# EasyEDA schematic Magellan ISO - Board B.json
TITLE: Magellan ISO - Board B; REV: 1.0; Date: 2017-10-26; Sheet: 1/1; Drawn By: mgizmor37
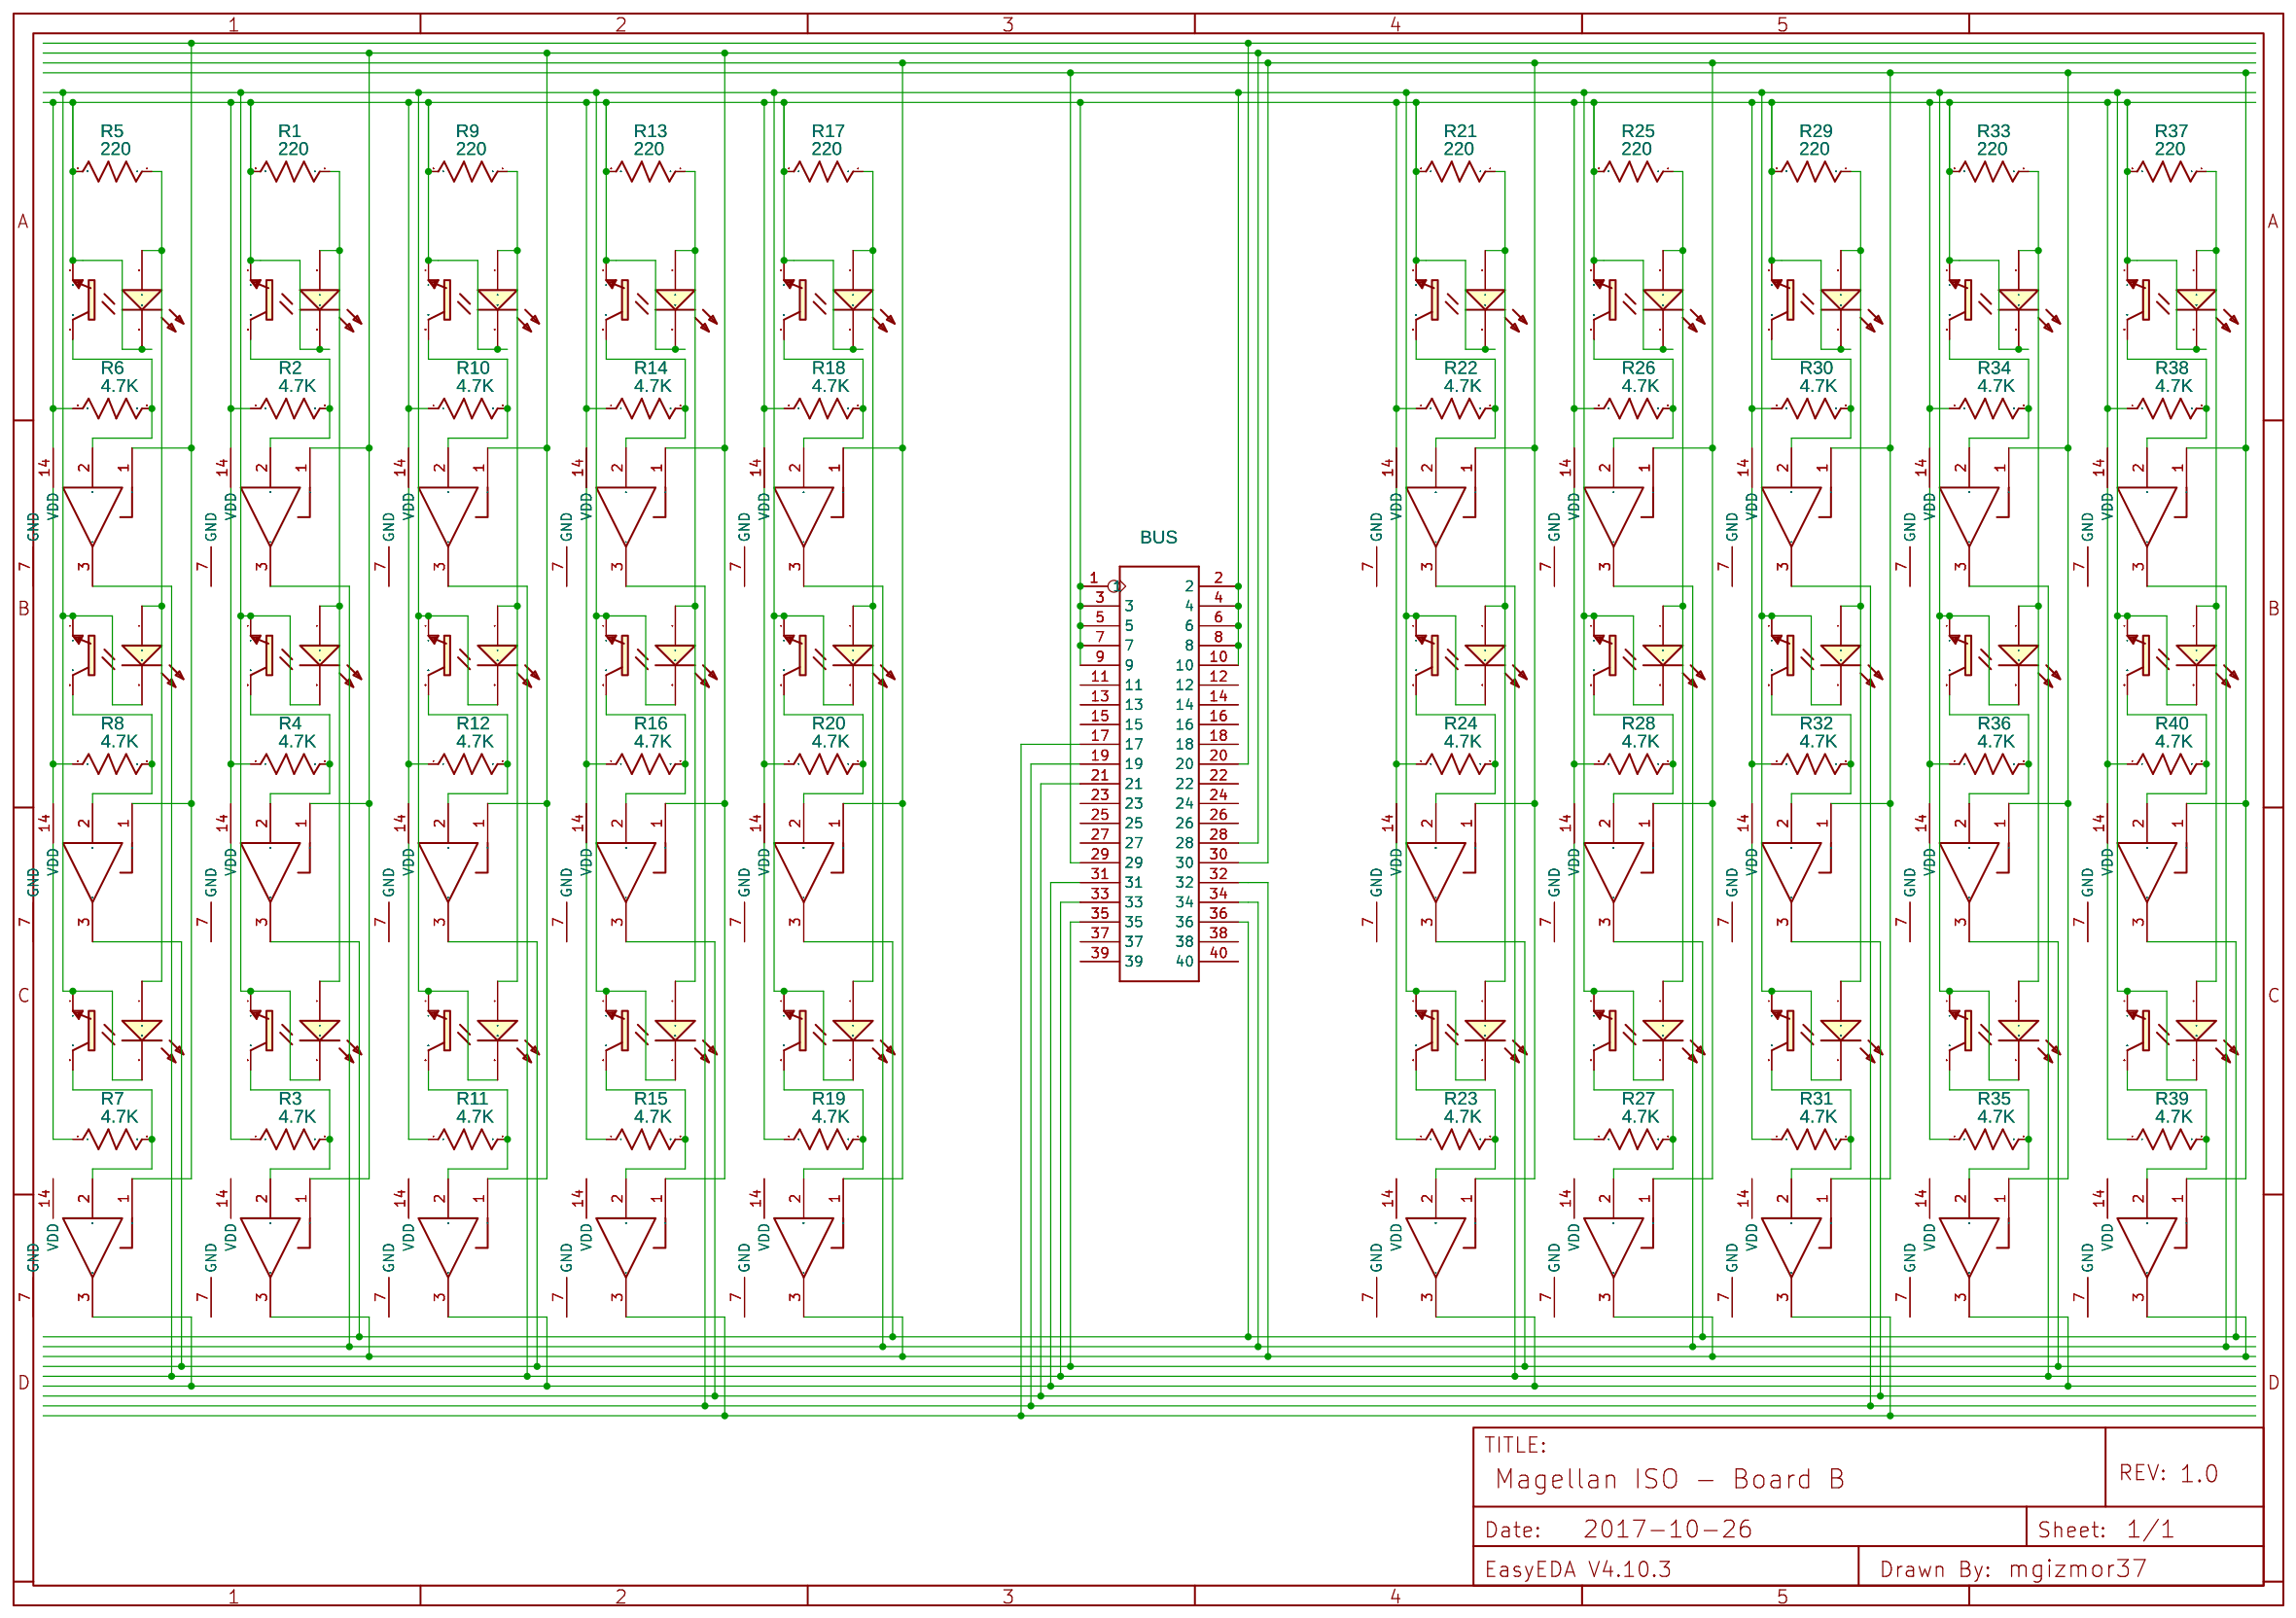
[diagram p0: schematic sheet]

## Parts
BUS  DIP-BLACK-HEADER-FEMALE-VERT-RASPPI(2X13P-2.54)  [40 Pin Header (Rasp Pi Layout)]
LED1  204-10UYC/S530-A3  [LED-3MM/2.54]
LED2  204-10UYC/S530-A3  [LED-3MM/2.54]
LED3  204-10UYC/S530-A3  [LED-3MM/2.54]
LED4  204-10UYC/S530-A3  [LED-3MM/2.54]
LED5  204-10UYC/S530-A3  [LED-3MM/2.54]
LED6  204-10UYC/S530-A3  [LED-3MM/2.54]
LED7  204-10UYC/S530-A3  [LED-3MM/2.54]
LED8  204-10UYC/S530-A3  [LED-3MM/2.54]
LED9  204-10UYC/S530-A3  [LED-3MM/2.54]
LED10  204-10UYC/S530-A3  [LED-3MM/2.54]
LED11  204-10UYC/S530-A3  [LED-3MM/2.54]
LED12  204-10UYC/S530-A3  [LED-3MM/2.54]
LED13  204-10UYC/S530-A3  [LED-3MM/2.54]
LED14  204-10UYC/S530-A3  [LED-3MM/2.54]
LED15  204-10UYC/S530-A3  [LED-3MM/2.54]
LED16  204-10UYC/S530-A3  [LED-3MM/2.54]
LED17  204-10UYC/S530-A3  [LED-3MM/2.54]
LED18  204-10UYC/S530-A3  [LED-3MM/2.54]
LED19  204-10UYC/S530-A3  [LED-3MM/2.54]
LED20  204-10UYC/S530-A3  [LED-3MM/2.54]
LED21  204-10UYC/S530-A3  [LED-3MM/2.54]
LED22  204-10UYC/S530-A3  [LED-3MM/2.54]
LED23  204-10UYC/S530-A3  [LED-3MM/2.54]
LED24  204-10UYC/S530-A3  [LED-3MM/2.54]
LED25  204-10UYC/S530-A3  [LED-3MM/2.54]
LED26  204-10UYC/S530-A3  [LED-3MM/2.54]
LED27  204-10UYC/S530-A3  [LED-3MM/2.54]
LED28  204-10UYC/S530-A3  [LED-3MM/2.54]
LED29  204-10UYC/S530-A3  [LED-3MM/2.54]
LED30  204-10UYC/S530-A3  [LED-3MM/2.54]
Q1  PHOTOTRANSISTORPT17-21C-L41-TR8  [PT17-21C-L41-TR8]
Q2  PHOTOTRANSISTORPT17-21C-L41-TR8  [PT17-21C-L41-TR8]
Q3  PHOTOTRANSISTORPT17-21C-L41-TR8  [PT17-21C-L41-TR8]
Q4  PHOTOTRANSISTORPT17-21C-L41-TR8  [PT17-21C-L41-TR8]
Q5  PHOTOTRANSISTORPT17-21C-L41-TR8  [PT17-21C-L41-TR8]
Q6  PHOTOTRANSISTORPT17-21C-L41-TR8  [PT17-21C-L41-TR8]
Q7  PHOTOTRANSISTORPT17-21C-L41-TR8  [PT17-21C-L41-TR8]
Q8  PHOTOTRANSISTORPT17-21C-L41-TR8  [PT17-21C-L41-TR8]
Q9  PHOTOTRANSISTORPT17-21C-L41-TR8  [PT17-21C-L41-TR8]
Q10  PHOTOTRANSISTORPT17-21C-L41-TR8  [PT17-21C-L41-TR8]
Q11  PHOTOTRANSISTORPT17-21C-L41-TR8  [PT17-21C-L41-TR8]
Q12  PHOTOTRANSISTORPT17-21C-L41-TR8  [PT17-21C-L41-TR8]
Q13  PHOTOTRANSISTORPT17-21C-L41-TR8  [PT17-21C-L41-TR8]
Q14  PHOTOTRANSISTORPT17-21C-L41-TR8  [PT17-21C-L41-TR8]
Q15  PHOTOTRANSISTORPT17-21C-L41-TR8  [PT17-21C-L41-TR8]
Q16  PHOTOTRANSISTORPT17-21C-L41-TR8  [PT17-21C-L41-TR8]
Q17  PHOTOTRANSISTORPT17-21C-L41-TR8  [PT17-21C-L41-TR8]
Q18  PHOTOTRANSISTORPT17-21C-L41-TR8  [PT17-21C-L41-TR8]
Q19  PHOTOTRANSISTORPT17-21C-L41-TR8  [PT17-21C-L41-TR8]
Q20  PHOTOTRANSISTORPT17-21C-L41-TR8  [PT17-21C-L41-TR8]
Q21  PHOTOTRANSISTORPT17-21C-L41-TR8  [PT17-21C-L41-TR8]
Q22  PHOTOTRANSISTORPT17-21C-L41-TR8  [PT17-21C-L41-TR8]
Q23  PHOTOTRANSISTORPT17-21C-L41-TR8  [PT17-21C-L41-TR8]
Q24  PHOTOTRANSISTORPT17-21C-L41-TR8  [PT17-21C-L41-TR8]
Q25  PHOTOTRANSISTORPT17-21C-L41-TR8  [PT17-21C-L41-TR8]
Q26  PHOTOTRANSISTORPT17-21C-L41-TR8  [PT17-21C-L41-TR8]
Q27  PHOTOTRANSISTORPT17-21C-L41-TR8  [PT17-21C-L41-TR8]
Q28  PHOTOTRANSISTORPT17-21C-L41-TR8  [PT17-21C-L41-TR8]
Q29  PHOTOTRANSISTORPT17-21C-L41-TR8  [PT17-21C-L41-TR8]
Q30  PHOTOTRANSISTORPT17-21C-L41-TR8  [PT17-21C-L41-TR8]
R1  220  [AXIAL-0.3]
R2  4.7K  [AXIAL-0.3]
R3  4.7K  [AXIAL-0.3]
R4  4.7K  [AXIAL-0.3]
R5  220  [AXIAL-0.3]
R6  4.7K  [AXIAL-0.3]
R7  4.7K  [AXIAL-0.3]
R8  4.7K  [AXIAL-0.3]
R9  220  [AXIAL-0.3]
R10  4.7K  [AXIAL-0.3]
R11  4.7K  [AXIAL-0.3]
R12  4.7K  [AXIAL-0.3]
R13  220  [AXIAL-0.3]
R14  4.7K  [AXIAL-0.3]
R15  4.7K  [AXIAL-0.3]
R16  4.7K  [AXIAL-0.3]
R17  220  [AXIAL-0.3]
R18  4.7K  [AXIAL-0.3]
R19  4.7K  [AXIAL-0.3]
R20  4.7K  [AXIAL-0.3]
R21  220  [AXIAL-0.3]
R22  4.7K  [AXIAL-0.3]
R23  4.7K  [AXIAL-0.3]
R24  4.7K  [AXIAL-0.3]
R25  220  [AXIAL-0.3]
R26  4.7K  [AXIAL-0.3]
R27  4.7K  [AXIAL-0.3]
R28  4.7K  [AXIAL-0.3]
R29  220  [AXIAL-0.3]
R30  4.7K  [AXIAL-0.3]
R31  4.7K  [AXIAL-0.3]
R32  4.7K  [AXIAL-0.3]
R33  220  [AXIAL-0.3]
R34  4.7K  [AXIAL-0.3]
R35  4.7K  [AXIAL-0.3]
R36  4.7K  [AXIAL-0.3]
R37  220  [AXIAL-0.3]
R38  4.7K  [AXIAL-0.3]
R39  4.7K  [AXIAL-0.3]
R40  4.7K  [AXIAL-0.3]
U1  SN74LS125AN  [DIP14]  (section 1)
U2  SN74LS125AN  [DIP14]  (section 1)
U3  SN74LS125AN  [DIP14]  (section 1)
U4  SN74LS125AN  [DIP14]  (section 1)
U5  SN74LS125AN  [DIP14]  (section 1)
U6  SN74LS125AN  [DIP14]  (section 1)
U7  SN74LS125AN  [DIP14]  (section 1)
U8  SN74LS125AN  [DIP14]  (section 1)
U9  SN74LS125AN  [DIP14]  (section 1)
U10  SN74LS125AN  [DIP14]  (section 1)
U11  SN74LS125AN  [DIP14]  (section 1)
U12  SN74LS125AN  [DIP14]  (section 1)
U13  SN74LS125AN  [DIP14]  (section 1)
U14  SN74LS125AN  [DIP14]  (section 1)
U15  SN74LS125AN  [DIP14]  (section 1)
U16  SN74LS125AN  [DIP14]  (section 1)
U17  SN74LS125AN  [DIP14]  (section 1)
U18  SN74LS125AN  [DIP14]  (section 1)
U19  SN74LS125AN  [DIP14]  (section 1)
U20  SN74LS125AN  [DIP14]  (section 1)
U21  SN74LS125AN  [DIP14]  (section 1)
U22  SN74LS125AN  [DIP14]  (section 1)
U23  SN74LS125AN  [DIP14]  (section 1)
U24  SN74LS125AN  [DIP14]  (section 1)
U25  SN74LS125AN  [DIP14]  (section 1)
U26  SN74LS125AN  [DIP14]  (section 1)
U27  SN74LS125AN  [DIP14]  (section 1)
U28  SN74LS125AN  [DIP14]  (section 1)
U29  SN74LS125AN  [DIP14]  (section 1)
U30  SN74LS125AN  [DIP14]  (section 1)

## Library data of the parts
BUS = -: DIP Black Header Female VERT;; catid: 20; Supplier: Unknown; SeeedStudio: 320030034; Manufacturer Part: F185-1226A0BSYB1; sourceId: GMGARL3Xf
LED1-LED30 = -: LCSC: C73643; Supplier: LCSC; Manufacturer: EVERLIGHT
Q1-Q30 = -: catid: 20; Contributor: SparkFun; Manufacturer Part: ?
R1-R40 = Resistor: Manufacturer Part: ?
U1-U30 = -: Quad 3-State Buffer; catid: 20; Manufacturer Part: ?

## Nets
Net-(BUS-1): BUS.1 BUS.3 BUS.5 BUS.7 BUS.9 LED1.2(C) LED3.2(C) LED7.2(C) LED10.2(C) LED13.2(C) LED16.2(C) LED19.2(C) LED22.2(C) LED25.2(C) LED28.2(C) Q1.E Q3.E Q7.E Q10.E Q13.E Q16.E Q19.E Q22.E Q25.E Q28.E R1.2 R2.1 R3.1 R4.1 R5.2 R6.1 R7.1 R8.1 R9.2 R10.1 R11.1 R12.1 R13.2 R14.1 R15.1 R16.1 R17.2 R18.1 R19.1 R20.1 R21.2 R22.1 R23.1 R24.1 R25.2 R26.1 R27.1 R28.1 R29.2 R30.1 R31.1 R32.1 R33.2 R34.1 R35.1 R36.1 R37.2 R38.1 R39.1 R40.1
Net-(BUS-2): BUS.2 BUS.4 BUS.6 BUS.8 BUS.10 LED2.2(C) LED4.2(C) LED5.2(C) LED6.2(C) LED8.2(C) LED9.2(C) LED11.2(C) LED12.2(C) LED14.2(C) LED15.2(C) LED17.2(C) LED18.2(C) LED20.2(C) LED21.2(C) LED23.2(C) LED24.2(C) LED26.2(C) LED27.2(C) LED29.2(C) LED30.2(C) Q2.E Q4.E Q5.E Q6.E Q8.E Q9.E Q11.E Q12.E Q14.E Q15.E Q17.E Q18.E Q20.E Q21.E Q23.E Q24.E Q26.E Q27.E Q29.E Q30.E
Net-(BUS-17): BUS.17 U11.3(Y) U23.3(Y)
Net-(BUS-19): BUS.19 U10.3(Y) U22.3(Y)
Net-(BUS-20): BUS.20 U1.1(A) U5.1(A) U6.1(A)
Net-(BUS-21): BUS.21 U12.3(Y) U24.3(Y)
Net-(BUS-28): BUS.28 U2.1(A) U3.1(A) U4.1(A) U7.1(A) U8.1(A) U9.1(A) U10.1(A) U11.1(A) U12.1(A)
Net-(BUS-29): BUS.29 U22.1(A) U23.1(A) U24.1(A) U25.1(A) U26.1(A) U27.1(A) U28.1(A) U29.1(A) U30.1(A)
Net-(BUS-30): BUS.30 U13.1(A) U14.1(A) U15.1(A) U16.1(A) U17.1(A) U18.1(A) U19.1(A) U20.1(A) U21.1(A)
Net-(BUS-31): BUS.31 U5.3(Y) U8.3(Y) U17.3(Y) U26.3(Y)
Net-(BUS-32): BUS.32 U3.3(Y) U14.3(Y) U20.3(Y) U29.3(Y)
Net-(BUS-33): BUS.33 U1.3(Y) U7.3(Y) U16.3(Y) U25.3(Y)
Net-(BUS-34): BUS.34 U2.3(Y) U13.3(Y) U19.3(Y) U28.3(Y)
Net-(BUS-35): BUS.35 U6.3(Y) U9.3(Y) U18.3(Y) U27.3(Y)
Net-(BUS-36): BUS.36 U4.3(Y) U15.3(Y) U21.3(Y) U30.3(Y)
Net-(LED1-1): LED1.1(A) LED2.1(A) LED4.1(A) R1.1
Net-(LED3-1): LED3.1(A) LED5.1(A) LED6.1(A) R5.1
Net-(LED7-1): LED7.1(A) LED8.1(A) LED9.1(A) R9.1
Net-(LED10-1): LED10.1(A) LED11.1(A) LED12.1(A) R13.1
Net-(LED13-1): LED13.1(A) LED14.1(A) LED15.1(A) R17.1
Net-(LED16-1): LED16.1(A) LED17.1(A) LED18.1(A) R21.1
Net-(LED19-1): LED19.1(A) LED20.1(A) LED21.1(A) R25.1
Net-(LED22-1): LED22.1(A) LED23.1(A) LED24.1(A) R29.1
Net-(LED25-1): LED25.1(A) LED26.1(A) LED27.1(A) R33.1
Net-(LED28-1): LED28.1(A) LED29.1(A) LED30.1(A) R37.1
Net-(Q1-C): Q1.C R2.2 U2.2(B)
Net-(Q2-C): Q2.C R3.2 U3.2(B)
Net-(Q3-C): Q3.C R6.2 U1.2(B)
Net-(Q4-C): Q4.C R4.2 U4.2(B)
Net-(Q5-C): Q5.C R7.2 U5.2(B)
Net-(Q6-C): Q6.C R8.2 U6.2(B)
Net-(Q7-C): Q7.C R10.2 U7.2(B)
Net-(Q8-C): Q8.C R11.2 U8.2(B)
Net-(Q9-C): Q9.C R12.2 U9.2(B)
Net-(Q10-C): Q10.C R14.2 U10.2(B)
Net-(Q11-C): Q11.C R15.2 U11.2(B)
Net-(Q12-C): Q12.C R16.2 U12.2(B)
Net-(Q13-C): Q13.C R18.2 U13.2(B)
Net-(Q14-C): Q14.C R19.2 U14.2(B)
Net-(Q15-C): Q15.C R20.2 U15.2(B)
Net-(Q16-C): Q16.C R22.2 U16.2(B)
Net-(Q17-C): Q17.C R23.2 U17.2(B)
Net-(Q18-C): Q18.C R24.2 U18.2(B)
Net-(Q19-C): Q19.C R26.2 U19.2(B)
Net-(Q20-C): Q20.C R27.2 U20.2(B)
Net-(Q21-C): Q21.C R28.2 U21.2(B)
Net-(Q22-C): Q22.C R30.2 U22.2(B)
Net-(Q23-C): Q23.C R31.2 U23.2(B)
Net-(Q24-C): Q24.C R32.2 U24.2(B)
Net-(Q25-C): Q25.C R34.2 U25.2(B)
Net-(Q26-C): Q26.C R35.2 U26.2(B)
Net-(Q27-C): Q27.C R36.2 U27.2(B)
Net-(Q28-C): Q28.C R38.2 U28.2(B)
Net-(Q29-C): Q29.C R39.2 U29.2(B)
Net-(Q30-C): Q30.C R40.2 U30.2(B)

Not connected (* = marked no-connect by the designer): BUS 11 12 13 14 15 16 18 22 23 24 25 26 27 37 38 39 40; U1 7(GND) 14(VDD); U2 7(GND) 14(VDD); U3 7(GND) 14(VDD); U4 7(GND) 14(VDD); U5 7(GND) 14(VDD); U6 7(GND) 14(VDD); U7 7(GND) 14(VDD); U8 7(GND) 14(VDD); U9 7(GND) 14(VDD); U10 7(GND) 14(VDD); U11 7(GND) 14(VDD); U12 7(GND) 14(VDD); U13 7(GND) 14(VDD); U14 7(GND) 14(VDD); U15 7(GND) 14(VDD); U16 7(GND) 14(VDD); U17 7(GND) 14(VDD); U18 7(GND) 14(VDD); U19 7(GND) 14(VDD); U20 7(GND) 14(VDD); U21 7(GND) 14(VDD); U22 7(GND) 14(VDD); U23 7(GND) 14(VDD); U24 7(GND) 14(VDD); U25 7(GND) 14(VDD); U26 7(GND) 14(VDD); U27 7(GND) 14(VDD); U28 7(GND) 14(VDD); U29 7(GND) 14(VDD); U30 7(GND) 14(VDD)
